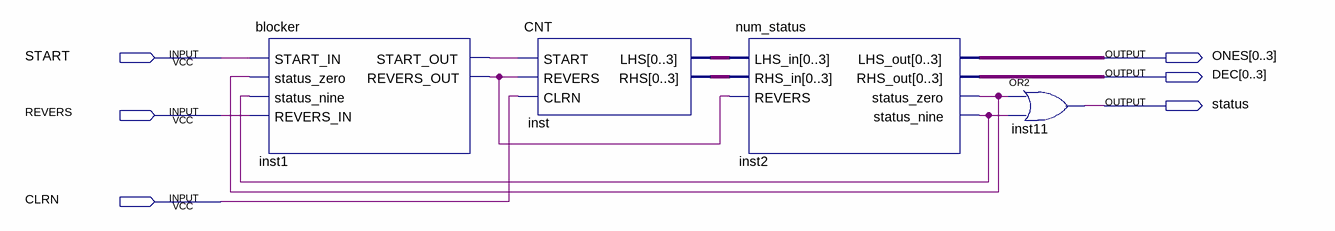
[diagram p0: schematic sheet]
// Quartus schematic counter_new.bdf as structural Verilog: 4 symbols, 6 pins
module counter_new (
  input  START,
  input  REVERS,
  input  CLRN,
  output [0:3] ONES,
  output [0:3] DEC,
  output status
);

  wire inst1_revers_out, inst1_start_out, inst2_status_nine, inst2_status_zero;
  wire [3:0] inst_lhs, inst_rhs;

  blocker inst1 (
    .START_IN(START), .status_zero(inst2_status_zero), .status_nine(inst2_status_nine), .REVERS_IN(REVERS),
    .START_OUT(inst1_start_out), .REVERS_OUT(inst1_revers_out));
  CNT inst (.START(inst1_start_out), .REVERS(inst1_revers_out), .CLRN(CLRN), .LHS(inst_lhs), .RHS(inst_rhs));
  num_status inst2 (
    .LHS_in(inst_lhs), .RHS_in(inst_rhs), .REVERS(inst1_revers_out), .LHS_out(ONES), .RHS_out(DEC),
    .status_zero(inst2_status_zero), .status_nine(inst2_status_nine));
  or inst11 (status, inst2_status_zero, inst2_status_nine);
endmodule
